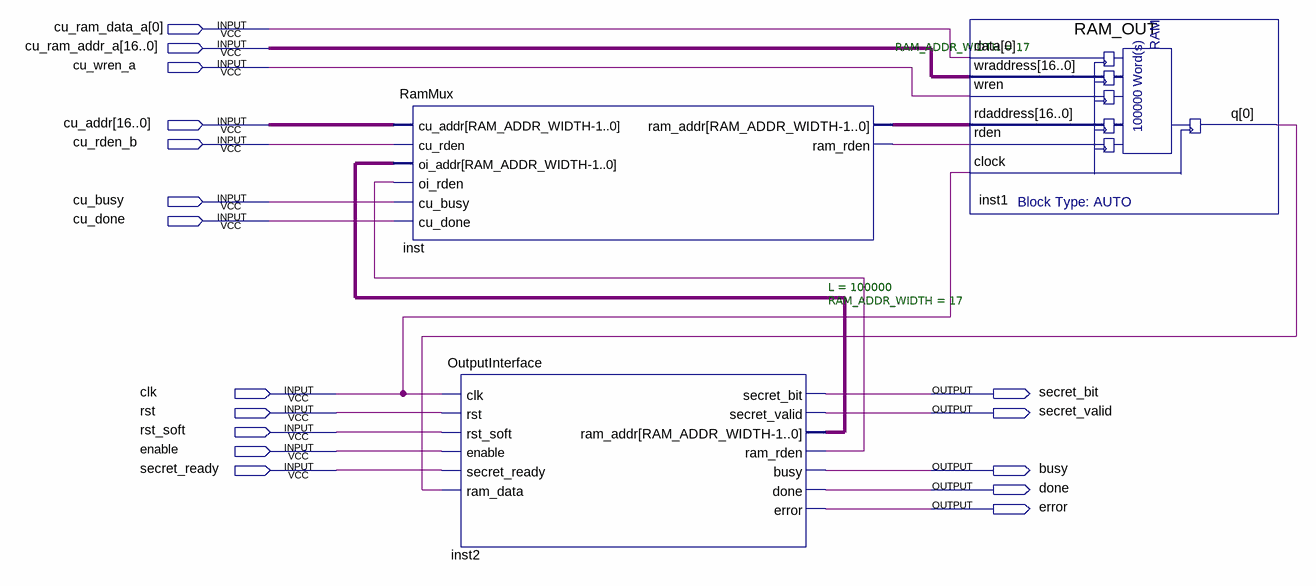
[diagram p0: schematic sheet]
// Quartus schematic PrivacyAmplification.bdf as structural Verilog: 3 symbols, 17 pins
module PrivacyAmplification (
  input  [0:0] cu_ram_data_a,
  input  [16:0] cu_ram_addr_a,
  input  cu_wren_a,
  input  [16:0] cu_addr,
  input  cu_rden_b,
  input  cu_busy,
  input  cu_done,
  input  clk,
  input  rst,
  input  rst_soft,
  input  enable,
  input  secret_ready,
  output secret_bit,
  output secret_valid,
  output busy,
  output done,
  output error
);

  wire inst1_q, inst2_ram_rden, inst_ram_rden;
  wire [16:0] inst2_ram_addr, inst_ram_addr;

  RamMux #(.RAM_ADDR_WIDTH(17)) inst (
    .cu_addr(cu_addr), .cu_rden(cu_rden_b), .oi_addr(inst2_ram_addr), .oi_rden(inst2_ram_rden),
    .cu_busy(cu_busy), .cu_done(cu_done), .ram_addr(inst_ram_addr), .ram_rden(inst_ram_rden));
  OutputInterface #(.L(100000), .RAM_ADDR_WIDTH(17)) inst2 (
    .clk(clk), .rst(rst), .rst_soft(rst_soft), .enable(enable), .secret_ready(secret_ready),
    .ram_data(inst1_q), .secret_bit(secret_bit), .secret_valid(secret_valid), .ram_addr(inst2_ram_addr),
    .ram_rden(inst2_ram_rden), .busy(busy), .done(done), .error(error));
  RAM_OUT inst1 (
    .data(cu_ram_data_a[0]), .wraddress(cu_ram_addr_a), .wren(cu_wren_a), .rdaddress(inst_ram_addr),
    .rden(inst_ram_rden), .clock(clk), .q(inst1_q));
endmodule
